# Altium project HW_RV_TOUCH_R1M1.PrjPcb (part 4 of 4)

## Sheet 14_LCD_TS_CT.SchDoc: =TitleParameter
size A3; Address: Crete IL; Organization: ASISGUARD; Address1: Kemalpasa, Kemalpasa Cd. No:290 D:292H, 35060 Bornova/Izmir/Turkey; Revision: R1M1
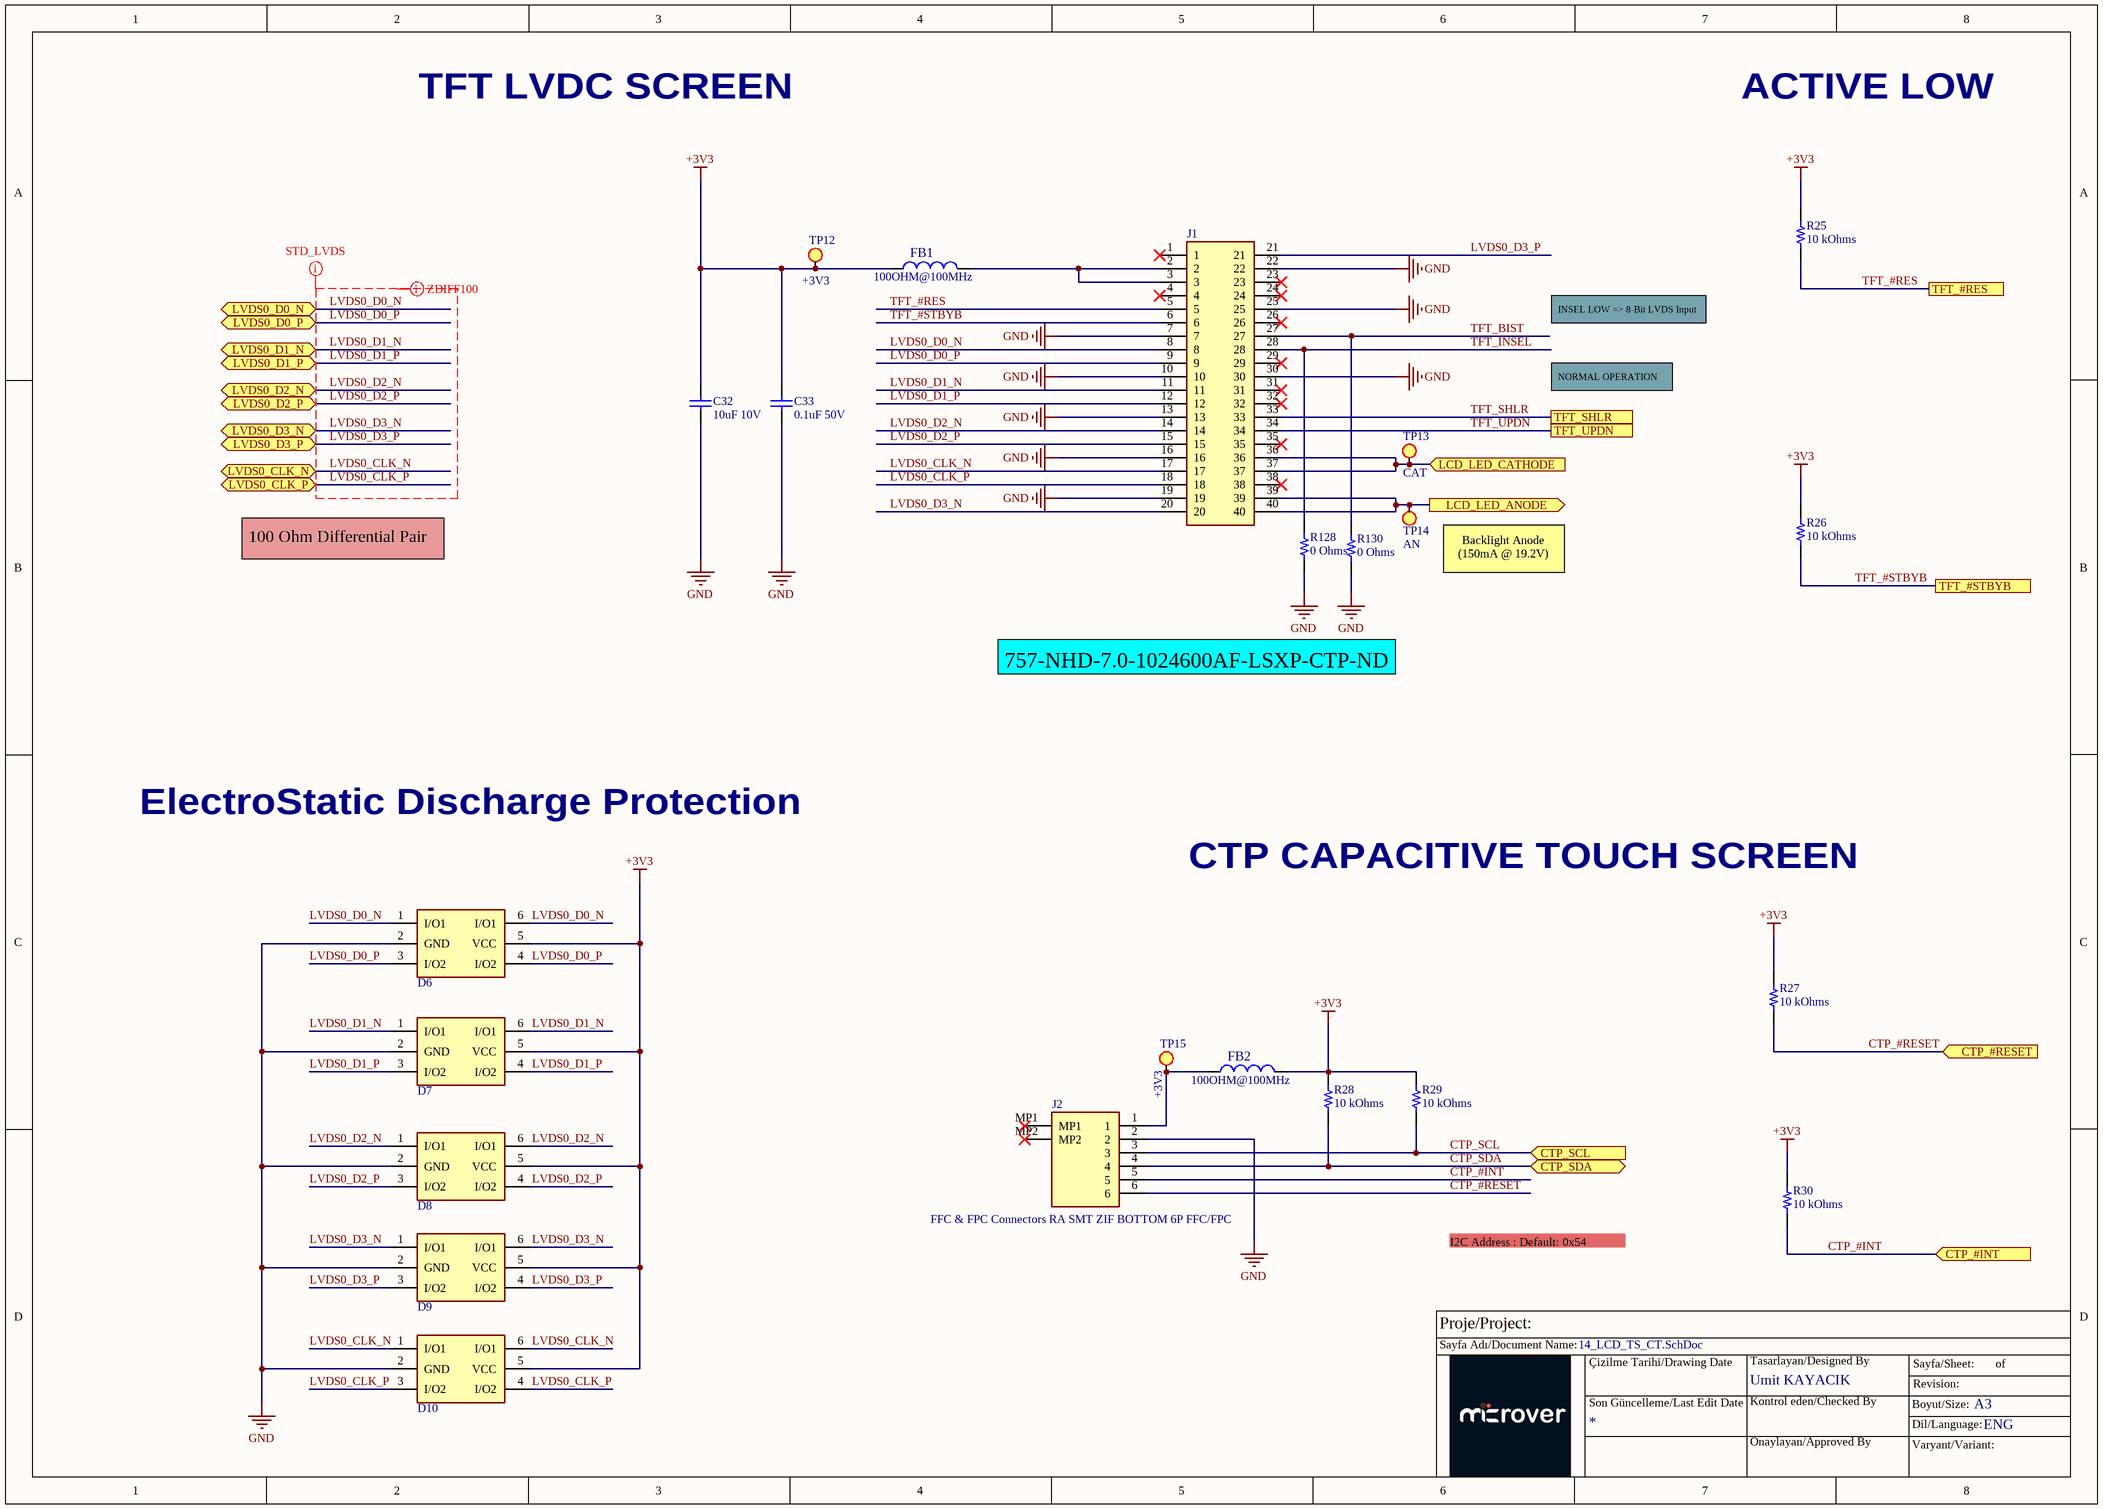
[diagram p13: 14_LCD_TS_CT.SchDoc]

### Parts
C32  value 10uF 10V  [SMC1206]  (hidden comment: CAP CER 10UF 10V X7R 1206)
C33  value 0.1uF 50V  [SMC0603]  (hidden comment: CAP CER 0.1UF 50V X7R 0603)
D6  SON-6(1x1.5) ESD Protection Devices ROHS  [Nexperia_SOT886_MFG]  (value not drawn)
D7  SON-6(1x1.5) ESD Protection Devices ROHS  [Nexperia_SOT886_MFG]  (value not drawn)
D8  SON-6(1x1.5) ESD Protection Devices ROHS  [Nexperia_SOT886_MFG]  (value not drawn)
D9  SON-6(1x1.5) ESD Protection Devices ROHS  [Nexperia_SOT886_MFG]  (value not drawn)
D10  SON-6(1x1.5) ESD Protection Devices ROHS  [Nexperia_SOT886_MFG]  (value not drawn)
FB1  100OHM@100MHz  [FB 0603(1608)]
FB2  100OHM@100MHz  [FB 0603(1608)]
J1  FFC & FPC Connectors 0.5 FPC ZIF SMT R/AU prCont40CktEmbsTpPk  [54104-4031]  (value not drawn)
J2  FFC & FPC Connectors RA SMT ZIF BOTTOM 6P FFC/FPC  [522710679]
R25  10 kOhms  [RES 0402_1005]
R26  10 kOhms  [RES 0402_1005]
R27  10 kOhms  [RES 0402_1005]
R28  10 kOhms  [RES 0402_1005]
R29  10 kOhms  [RES 0402_1005]
R30  10 kOhms  [RES 0402_1005]
R128  0 Ohms  [RES0402(1005)]
R130  0 Ohms  [RES0402(1005)]
TP12  +3V3  [TEST_POINT]
TP13  CAT  [TEST_POINT]
TP14  AN  [TEST_POINT]
TP15  +3V3  [TEST_POINT]

### Ports
CTP_#INT (in), CTP_#RESET (in), CTP_SCL (in), CTP_SDA (bidir), LCD_LED_ANODE (out), LCD_LED_CATHODE (in), LVDS0_CLK_N (bidir), LVDS0_CLK_P (bidir), LVDS0_D0_N (bidir), LVDS0_D0_P (bidir), LVDS0_D1_N (bidir), LVDS0_D1_P (bidir), LVDS0_D2_N (bidir), LVDS0_D2_P (bidir), LVDS0_D3_N (bidir), LVDS0_D3_P (bidir), TFT_#RES, TFT_#STBYB, TFT_SHLR, TFT_UPDN

### Nets
+3V3: C32.2 C33.2 D6.5(VCC) D7.5(VCC) D8.5(VCC) D9.5(VCC) D10.5(VCC) FB1.2 FB2.1 R25.2 R26.2 R27.2 R28.2 R29.2 R30.2 TP12.1(TP)
GND: C32.1 C33.1 D6.2(GND) D7.2(GND) D8.2(GND) D9.2(GND) D10.2(GND) J1.7 J1.10 J1.13 J1.16 J1.19 J1.22 J1.25 J1.30 J2.2 R128.2 R130.2
CTP_#INT: J2.5 R30.1 ; port CTP_#INT
CTP_#RESET: J2.6 R27.1 ; port CTP_#RESET
CTP_SCL: J2.3 R29.1 ; port CTP_SCL
CTP_SDA: J2.4 R28.1 ; port CTP_SDA
LCD_LED_ANODE: J1.39 J1.40 TP14.1(TP) ; port LCD_LED_ANODE
LCD_LED_CATHODE: J1.36 J1.37 TP13.1(TP) ; port LCD_LED_CATHODE
LVDS0_CLK_N: D10.1(I/O1) D10.6(I/O1) J1.17 ; port LVDS0_CLK_N
LVDS0_CLK_P: D10.3(I/O2) D10.4(I/O2) J1.18 ; port LVDS0_CLK_P
LVDS0_D0_N: D6.1(I/O1) D6.6(I/O1) J1.8 ; port LVDS0_D0_N
LVDS0_D0_P: D6.3(I/O2) D6.4(I/O2) J1.9 ; port LVDS0_D0_P
LVDS0_D1_N: D7.1(I/O1) D7.6(I/O1) J1.11 ; port LVDS0_D1_N
LVDS0_D1_P: D7.3(I/O2) D7.4(I/O2) J1.12 ; port LVDS0_D1_P
LVDS0_D2_N: D8.1(I/O1) D8.6(I/O1) J1.14 ; port LVDS0_D2_N
LVDS0_D2_P: D8.3(I/O2) D8.4(I/O2) J1.15 ; port LVDS0_D2_P
LVDS0_D3_N: D9.1(I/O1) D9.6(I/O1) J1.20 ; port LVDS0_D3_N
LVDS0_D3_P: D9.3(I/O2) D9.4(I/O2) J1.21 ; port LVDS0_D3_P
TFT_#RES: J1.5 R25.1 ; port TFT_#RES
TFT_#STBYB: J1.6 R26.1 ; port TFT_#STBYB
TFT_BIST: J1.27 R130.1
TFT_INSEL: J1.28 R128.1
TFT_SHLR: J1.33 ; port TFT_SHLR
TFT_UPDN: J1.34 ; port TFT_UPDN
NetFB1_1: FB1.1 J1.2 J1.3
NetFB2_2: FB2.2 J2.1 TP15.1(TP)

Not connected (* = marked no-connect by the designer): J1 1* 4* 23* 24* 26* 29* 31* 32* 35* 38*; J2 MP1* MP2*

### Layout directives
net class STD_LVDS: LVDS0_CLK_N, LVDS0_CLK_P, LVDS0_D0_N, LVDS0_D0_P, LVDS0_D1_N, LVDS0_D1_P, LVDS0_D2_N, LVDS0_D2_P, LVDS0_D3_N, LVDS0_D3_P
differential pair; differential pair class ZDIFF100: LVDS0_CLK_N, LVDS0_CLK_P, LVDS0_D0_N, LVDS0_D0_P, LVDS0_D1_N, LVDS0_D1_P, LVDS0_D2_N, LVDS0_D2_P, LVDS0_D3_N, LVDS0_D3_P

### Notes on the sheet
- TFT LVDC SCREEN
- ACTIVE LOW
- INSEL LOW => 8-Bit LVDS Input
- NORMAL OPERATION
- 100 Ohm Differential Pair
- (near TP14) Backlight Anode (150mA @ 19.2V)
- 757-NHD-7.0-1024600AF-LSXP-CTP-ND
- ElectroStatic Discharge Protection
- CTP CAPACITIVE TOUCH SCREEN
- I2C Address : Default: 0x54
- Proje/Project:
- Sayfa Adı/Document Name:
- Çizilme Tarihi/Drawing Date
- Umit KAYACIK
- Tasarlayan/Designed By
- Sayfa/Sheet:
- Revision:
- of
- Son Güncelleme/Last Edit Date
- Kontrol eden/Checked By
- Onaylayan/Approved By
- Boyut/Size:
- Varyant/Variant:
- Dil/Language:
- A3
- ENG

### Library data of the parts
C32 = CAP1206_10UF_10V: 10 µF ±10% 10V Ceramic Capacitor X7R 1206 (3216 Metric); Manufacturer Part Number: CL31B106KPHNNNE; Order Code: Digi: 1276-1311-2-ND; Sirius Stock Code: *; LCSC Part Number: C96449; LCSC Manufacturer Part Number: CL31B106KPHNNNE
C33 = CAP0603_0.1UF_50V: 0.1 µF ±10% 50V Ceramic Capacitor X7R 0603 (1608 Metric); Manufacturer Part Number: CL10B104KB8NNNL; LCSC Manufacturer Part Number: CL10B104KB8NNNC; Order Code: DIGI:1276-CL10B104KB8NNNLTR-ND; Sirius Stock Code: A063-AGC10300001226; LCSC Part Number: C1591
D6-D10 = PRTR5V0U2F: Order Code: LCSC: C2937001; Manufacturer Part Number: PRTR5V0U2F; LCSC Manufacturer Part Number: PRTR5V0U2F; LCSC Part Number: C2937001
FB1 FB2 = FB0603_100OHM_100MHz: 100 Ohms @ 100 MHz 1 Power Line Ferrite Bead 0603 (1608 Metric) 2A 40mOhm; Manufacturer: TDK; Manufacturer Part Number: MPZ1608Y101BTA00; Tolerance: 25%; Impedance: 100R; DC Resistance (DCR): 40mR; ComponentLink1URL: https://chn-vm-apps.microchip.com/mchprepo/parts/Datasheets/beads_commercial_power_mpz_en.pdf; ComponentLink1Description: Datasheet; Supplier 1: Digi-Key; Supplier Part Number 1: 445-2984-1-ND; RoHS: Yes; Category: Ferrite Beads and Chips; Stock 1: 551; Pricing 1: 1=0,10000, 10=0,07200, 25=0,06480, 50=0,05840, 100=0,04290, 250=0,03120, 500=0,02860, 1000=0,02470 (USD); Mount: Surface Mount; Case/Package: 0603; Case Code (Metric): 1608; Case Code (Imperial): 0603; Core Material: Ferrite; Packaging: Tape and Reel; Package Quantity: 4000; Max DC Current: 2A; Current Rating: 2A; Series: MPZ; Length: 0.063inch; Width: 0.031inch; Height: 0.037inch; RoHS Compliant: Yes; REACH SVHC: No SVHC; ComponentLink2URL: https://datasheet.ciiva.com/46634/beads-commercial-power-mpz-en-46634677.pdf?src-supplier=Digi-Key; ComponentLink2Description: https://datasheet.ciiva.com/46634/beads-commercial-power-mpz-en-46634677.pdf?src-supplier=Digi-Key; ComponentLink3URL: https://datasheet.ciiva.com/48682/beads-commercial-power-mpz-en-48682501.pdf?src-supplier=Avnet; ComponentLink3Description: https://datasheet.ciiva.com/48682/beads-commercial-power-mpz-en-48682501.pdf?src-supplier=Avnet; ComponentLink4URL: https://datasheet.ciiva.com/46634/beads-commercial-power-mpz-en-46634684.pdf?src-supplier=Digi-Key; ComponentLink4Description: https://datasheet.ciiva.com/46634/beads-commercial-power-mpz-en-46634684.pdf?src-supplier=Digi-Key; ComponentLink5URL: https://datasheet.ciiva.com/46634/beads-commercial-power-mpz-en-46634621.pdf?src-supplier=Digi-Key; ComponentLink5Description: https://datasheet.ciiva.com/46634/beads-commercial-power-mpz-en-46634621.pdf?src-supplier=Digi-Key; Parameter 1: *; LCSC Manufacturer Part Number: MPZ1608Y101BTA00; LCSC Part Number: C501996
J1 = 54104-4031: Conn FFC/FPC Connector SKT 40 POS 0.5mm Solder RA SMD Easy-On™ T/R; Manufacturer: Molex; Actuator Material: Glass,Polyphenylene; Actuator Color: Brown; Plating: 157ConductorMaterial; Number of Contacts: 40; Voltage Rating: 50V; Contact Resistance: 20mR; Current Rating: 500mA; Wire/Cable Type: Straight; Mating Cycles: 20; Contact Location: Top; Gender: Receptacle; Number of Circuits: 40NUMBER; Stackable: 5898YesNo; Supplier 1: Mouser; Manufacturer Part Number: 54104-4031; RoHS: Yes; Category: FFC / FPC; Stock 1: 10870; Pricing 1: 1=3,22, 10=2,84, 50=2,84, 100=2,03, 1000=2,03, 10000=1,76 (USD); Mount: Surface Mount; Contact Material: Bronze; Contact Plating: Unplated,Gold; Housing Color: Natural; Housing Material: Nylon; Material: 150ConductorMaterial; Min Operating Temperature: -20°C; Max Operating Temperature: 85°C; Number of Rows: 1; Termination: Solder; Orientation: Right Angle; Packaging: Tape and Reel; Package Quantity: 1500; Number of Positions: 40; Series: 54104; Length: 25.5mm; Pitch: 0.5mm; Depth: 5.6mm; Radiation Hardening: No; Flammability Rating: UL94 V-0; RoHS Compliant: Yes; Reach SVHC Compliant: Unknown; ELV: 5681ELVCompliant; Supplier Part Number 1: 538-54104-4031
J2 = 52271-0679: FFC/FPC SMT SER 1mm Pitch 6Way RightAngle SMT Female FPC Conn; ZIF Bottom Contact; Manufacturer: Molex; Supplier 1: Mouser; Manufacturer Part Number: 52271-0679; RoHS: Yes; Category: FFC / FPC; Stock 1: 7632; Pricing 1: 1=1,1, 10=0,906, 50=0,906, 100=0,755, 1000=0,604, 10000=0,491 (USD); ComponentLink1URL: https://datasheet.ciiva.com/27051/1301235-27051913.pdf?src-supplier=Jameco; ComponentLink1Description: https://datasheet.ciiva.com/27051/1301235-27051913.pdf?src-supplier=Jameco; ComponentLink2URL: https://datasheet.ciiva.com/5136/0522710679-ffc-fpc-connectors-149405-5136769.pdf?src-supplier=Mouser; ComponentLink2Description: https://datasheet.ciiva.com/5136/0522710679-ffc-fpc-connectors-149405-5136769.pdf?src-supplier=Mouser; ComponentLink3URL: https://datasheet.ciiva.com/30226/212340522710679-ffc-fpc-nectors-30226867.pdf?src-supplier=Onlinecomponents.com; ComponentLink3Description: https://datasheet.ciiva.com/30226/212340522710679-ffc-fpc-nectors-30226867.pdf?src-supplier=Onlinecomponents.com; ComponentLink4URL: https://datasheet.ciiva.com/10034/0522710679-ffc-fpc-connectors-10034899.pdf?src-supplier=Avnet; ComponentLink4Description: https://datasheet.ciiva.com/10034/0522710679-ffc-fpc-connectors-10034899.pdf?src-supplier=Avnet; ComponentLink5URL: https://datasheet.ciiva.com/16123/203510522710679-ffc-fpc-nectors-16123334.pdf?src-supplier=Onlinecomponents.com; ComponentLink5Description: https://datasheet.ciiva.com/16123/203510522710679-ffc-fpc-nectors-16123334.pdf?src-supplier=Onlinecomponents.com; ComponentLink6URL: https://datasheet.ciiva.com/8038/704159-8038352.pdf?src-supplier=Element14; ComponentLink6Description: https://datasheet.ciiva.com/8038/704159-8038352.pdf?src-supplier=Element14; ComponentLink7URL: https://datasheet.ciiva.com/11745/0900766b8078fc42-11745220.pdf?src-supplier=Rs; ComponentLink7Description: https://datasheet.ciiva.com/11745/0900766b8078fc42-11745220.pdf?src-supplier=Rs; ComponentLink8URL: https://datasheet.ciiva.com/14483/704159-14483351.pdf?src-supplier=Farnell; ComponentLink8Description: https://datasheet.ciiva.com/14483/704159-14483351.pdf?src-supplier=Farnell; Supplier Part Number 1: 538-52271-0679
R25-R30 = RP73PF1E10KBTD: RES 10K OHM 0.1% 1/10W 0402; Manufacturer: TE Connectivity Passive Product; Power (Watts): 0.1W, 1/10W; Temperature Coefficient: ±25ppm/°C; Part Number: RP73PF1E10KBTD; Value: 10 kOhms; ComponentLink1Description: Datasheet; ComponentLink1URL: https://www.te.com/commerce/DocumentDelivery/DDEController?Action=srchrtrv&DocNm=1773272&DocType=DS&DocLang=English; ComponentLink2Description: DigiKey Link; ComponentLink2URL: https://www.digikey.com/en/products/detail/te-connectivity-passive-product/RP73PF1E10KBTD/8260957; Composition: Thin Film; Device Package: 0402 (1005 Metric); Height - Seated (Max): 0.014" (0.35mm); LastUpdated: 2/9/2024 8:30:24 PM; Lifecycle Status: Active; Minimum Order: 1; Number of Terminations: 2; Operating Temperature: -55°C ~ 155°C; Package / Case: 0402 (1005 Metric); Packaging: TapeAndReel; PartId: 2434; Part Status: Active; Price: 0.08; Resistance: 10 kOhms; Series: RP73, Holsworthy; Size / Dimension: 0.039" L x 0.020" W (1.00mm x 0.50mm); Supplier 1: DigiKey; Supplier Part Number 1: A127415CT-ND; Supplier Device Package: 0402; Tolerance: ±0.1%
R128 R130 = HCJ0402ZT0R00: RES 0 OHM JUMPER 1/8W 0402; Manufacturer: Stackpole Electronics Inc; Power (Watts): 0.125W, 1/8W; Part Number: HCJ0402ZT0R00; Value: 0 Ohms; ComponentLink1Description: Datasheet; ComponentLink1URL: https://www.seielect.com/catalog/sei-hcj.pdf; ComponentLink2Description: DigiKey Link; ComponentLink2URL: https://www.digikey.com/en/products/detail/stackpole-electronics-inc/HCJ0402ZT0R00/4357659; Composition: Metal Foil; Device Package: 0402 (1005 Metric); Features: Automotive AEC-Q200; Height - Seated (Max): 0.018" (0.45mm); LastUpdated: 2/9/2024 8:29:49 PM; Lifecycle Status: Active; Minimum Order: 1; Number of Terminations: 2; Operating Temperature: -55°C ~ 155°C; Package / Case: 0402 (1005 Metric); Packaging: TapeAndReel; PartId: 12327; Part Status: Active; Price: 0.07; Ratings: AEC-Q200; Resistance: 0 Ohms; Series: HCJ; Size / Dimension: 0.039" L x 0.020" W (1.00mm x 0.50mm); Supplier 1: DigiKey; Supplier Part Number 1: HCJ0402ZT0R00CT-ND; Supplier Device Package: 0402; Tolerance: Jumper
TP12-TP15 = TP_1

## Sheet 15_CAN_BUS.SchDoc: =TitleParameter
size A3; Address: Crete IL; Organization: ASISGUARD; Address1: Kemalpasa, Kemalpasa Cd. No:290 D:292H, 35060 Bornova/Izmir/Turkey; Revision: R1M1
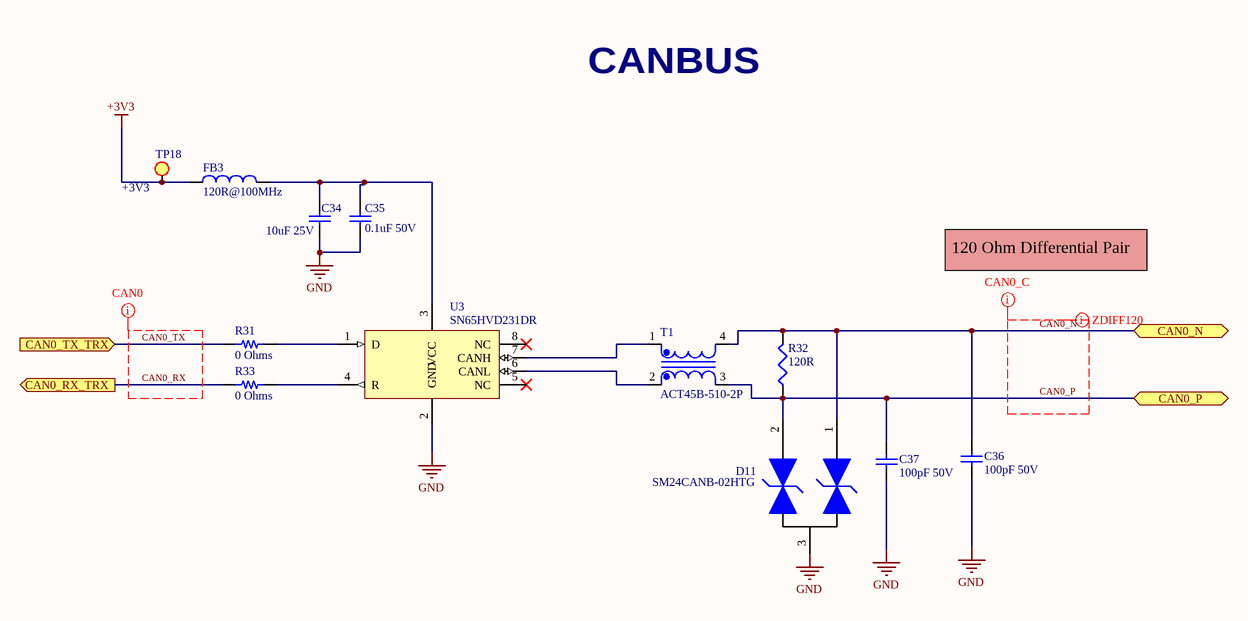
[diagram p14: 15_CAN_BUS.SchDoc]

### Parts
C34  value 10uF 25V  [SMC0805]  (hidden comment: CAP CER 10UF 25V X5R 0805)
C35  value 0.1uF 50V  [SMC0603]  (hidden comment: CAP CER 0.1UF 50V X7R 0603)
C36  value 100pF 50V  [SMC0603]  (hidden comment: CAP CER 100PF 50V C0G/NP0 0603)
C37  value 100pF 50V  [SMC0603]  (hidden comment: CAP CER 100PF 50V C0G/NP0 0603)
D11  Manufacturer Part Number: SM24CANB-02HTG  [SOT23_3-DIODE]  (hidden comment: CAN)
FB3  value 120R@100MHz  [FB 0603(1608)]  (hidden comment: FERRITE BEAD 120 OHM 0603 1LN)
R31  0 Ohms  [RES 0402_1005]
R32  value 120R  [RES1206]  (hidden comment: RES SMD 120 OHM 1% 1/4W 1206)
R33  0 Ohms  [RES 0402_1005]
T1  ACT45B-510-2P  [TDK_ACT45B-510-2P-TL003_0]
TP18  +3V3  [TEST_POINT]
U3  IC TRANSCEIVER HALF 1/1 8SOIC  [SOIC8 - duplicate]  (value not drawn)

### Ports
CAN0_N (bidir), CAN0_P (bidir), CAN0_RX_TRX (out), CAN0_TX_TRX (in)

### Nets
+3V3: FB3.1 TP18.1(TP)
GND: C34.1 C35.1 C36.1 C37.1 D11.3 U3.2(GND)
CAN0_N: C36.2 D11.1 R32.2 T1.4 ; port CAN0_N
CAN0_P: C37.2 D11.2 R32.1 T1.3 ; port CAN0_P
CAN0_RX: R33.2 ; port CAN0_RX_TRX
CAN0_TX: R31.2 ; port CAN0_TX_TRX
NetC34_2: C34.2 C35.2 FB3.2 U3.3(VCC)
NetR31_1: R31.1 U3.1(D)
NetR33_1: R33.1 U3.4(R)
NetT1_1: T1.1 U3.7(CANH)
NetT1_2: T1.2 U3.6(CANL)

Not connected (* = marked no-connect by the designer): U3 5(NC)* 8(NC)*

### Layout directives
differential pair; differential pair class ZDIFF120: CAN0_N, CAN0_P
net class CAN0_C: CAN0_N, CAN0_P
net class CAN0: CAN0_RX, CAN0_TX

### Notes on the sheet
- CANBUS
- 120 Ohm Differential Pair
- Proje/Project:
- Sayfa Adı/Document Name:
- Çizilme Tarihi/Drawing Date
- Umit KAYACIK
- Tasarlayan/Designed By
- Sayfa/Sheet:
- Revision:
- of
- Son Güncelleme/Last Edit Date
- Kontrol eden/Checked By
- Onaylayan/Approved By
- Boyut/Size:
- Varyant/Variant:
- Dil/Language:
- A3
- ENG

### Library data of the parts
C34 = CAP0805_10UF_25V: 10 µF ±10% 25V Ceramic Capacitor X5R 0805 (2012 Metric); Manufacturer Part Number: CL21A106KAYNNNE; Order Code: DIGI: 1276-2891-2-ND; Sirius Stock Code: *; LCSC Manufacturer Part Number: CL21A106KAYNNNE; LCSC Part Number: C15850
C35 = CAP0603_0.1UF_50V: as C33 on sheet 14_LCD_TS_CT; LCSC Part Number: C1591
C36 C37 = CAP0603_100PF_50V: 100 pF ±5% 50V Ceramic Capacitor C0G, NP0 0603 (1608 Metric); Manufacturer Part Number: 06035A101JAT2A; LCSC Manufacturer Part Number: CC0603JRNPO9BN101; Order Code: DIGI: 478-1175-2-ND; Sirius Stock Code: *; LCSC Part Number: C14665
D11 = SM24CANB-02HTG_TVS: TVS DIODE 24VWM 50VC SOT23-3; Order Code: DIGI : F6707CT-ND; Value: 2Ch; LCSC Manufacturer Part Number: SM24CANB-02HTG; LCSC Part Number: C151237
FB3 = FB0603_120R@100MHz: 120 Ohms @ 100 MHz 1 Power Line Ferrite Bead 0603 (1608 Metric) 3A 30mOhm; Manufacturer Part Number: BLM18KG121TH1D; Order Code: Digi:490-13261-2-ND; LCSC Manufacturer Part Number: BLM18KG121TH1D; LCSC Part Number: C437404
R31 R33 = HCJ0402ZT0R00: as R128 on sheet 14_LCD_TS_CT; Part Number: HCJ0402ZT0R00; Value: 0 Ohms; ComponentLink1Description: Datasheet; ComponentLink1URL: https://www.seielect.com/catalog/sei-hcj.pdf; ComponentLink2Description: DigiKey Link; ComponentLink2URL: https://www.digikey.com/en/products/detail/stackpole-electronics-inc/HCJ0402ZT0R00/4357659; Composition: Metal Foil; Device Package: 0402 (1005 Metric); Features: Automotive AEC-Q200; Height - Seated (Max): 0.018" (0.45mm); LastUpdated: 2/9/2024 8:29:49 PM; Lifecycle Status: Active; Minimum Order: 1; Number of Terminations: 2; Operating Temperature: -55°C ~ 155°C; Package / Case: 0402 (1005 Metric); Packaging: TapeAndReel; PartId: 12327; Part Status: Active; Price: 0.07; Ratings: AEC-Q200; Resistance: 0 Ohms; Series: HCJ; Size / Dimension: 0.039" L x 0.020" W (1.00mm x 0.50mm); Supplier 1: DigiKey; Supplier Part Number 1: HCJ0402ZT0R00CT-ND; Supplier Device Package: 0402; Tolerance: Jumper
R32 = RES1206_120R_%1: 120 Ohms ±1% 0.25W, 1/4W Chip Resistor 1206 (3216 Metric) Automotive AEC-Q200, Moisture Resistant Thick Film; Manufacturer Part Number: AC1206FR-07120RL; Order Code: Digi: YAG3810TR-ND; Sirius Stock Code: *; LCSC Manufacturer Part Number: AC1206FR-07120RL; LCSC Part Number: C229293
T1 = ACT45B-510-2P: Ind Common Mode Filter Wirewound 51uH 2KOhm -30% to 50% 100KHz 200mA 1812 T/R; Manufacturer: TDK; Manufacturer Part Number: ACT45B-510-2P-TL003; Core Material: Ferrite; Impedance: 2.8kR; DC Resistance (DCR): 1R; Number of Lines: 2; Voltage Rating (DC): 50V; Test Frequency: 10MHz; Insulation Resistance: 10MR; Element Configuration: Dual; Supplier 1: Digi-Key; Supplier Part Number 1: 445-3958-1-ND; RoHS: Yes; Category: Fixed Inductors; Stock 1: 75821; Pricing 1: 1=1,95000, 10=1,80000, 25=1,65000, 50=1,41000, 100=1,26000, 250=1,08000, 500=1,02000, 1000=0,93000 (USD); Mount: Surface Mount; Case/Package: 1812; Number of Pins: 4; Case Code (Imperial): 1812; Min Operating Temperature: -40°C; Max Operating Temperature: 150°C; Inductance: 51uH; Packaging: Tape and Reel; Package Quantity: 2000; Tolerance: 50%; Current Rating: 200mA; Max DC Current: 200mA; Current: 200mA; Voltage Rating: 50V; Termination: SMD/SMT; DC Current: 200mA; Self Resonant Frequency: 10MHz; Length: 4.7mm; Width: 3.2mm; Height: 2.8mm; Depth: 3.4mm; Radiation Hardening: No; REACH SVHC: No SVHC; Lead Free: Lead Free; Military Standard: Not; ComponentLink1URL: https://datasheet.ciiva.com/22726/1649098-22726290.pdf?src-supplier=Element14; ComponentLink1Description: https://datasheet.ciiva.com/22726/1649098-22726290.pdf?src-supplier=Element14; ComponentLink2URL: https://datasheet.ciiva.com/26793/act45b-510-2p-tl003-26793344.pdf?src-supplier=IIIC; ComponentLink2Description: https://datasheet.ciiva.com/26793/act45b-510-2p-tl003-26793344.pdf?src-supplier=IIIC; ComponentLink3URL: https://datasheet.ciiva.com/8498/e9711-act-8498633.pdf?src-supplier=Avnet; ComponentLink3Description: https://datasheet.ciiva.com/8498/e9711-act-8498633.pdf?src-supplier=Avnet; ComponentLink4URL: https://datasheet.ciiva.com/1007/e9711-act-1007931.pdf?src-supplier=Digi-Key; ComponentLink4Description: https://datasheet.ciiva.com/1007/e9711-act-1007931.pdf?src-supplier=Digi-Key; ComponentLink5URL: https://datasheet.ciiva.com/15191/getdatasheetpartid-349822-15191803.pdf?src-supplier=Verical; ComponentLink5Description: https://datasheet.ciiva.com/15191/getdatasheetpartid-349822-15191803.pdf?src-supplier=Verical; ComponentLink6URL: https://datasheet.ciiva.com/1007/e9711-act-1007932.pdf?src-supplier=Digi-Key; ComponentLink6Description: https://datasheet.ciiva.com/1007/e9711-act-1007932.pdf?src-supplier=Digi-Key; ComponentLink7URL: https://datasheet.ciiva.com/1007/e9711-act-1007933.pdf?src-supplier=Digi-Key; ComponentLink7Description: https://datasheet.ciiva.com/1007/e9711-act-1007933.pdf?src-supplier=Digi-Key; ComponentLink8URL: https://datasheet.ciiva.com/7649/1833202-7649183.pdf?src-supplier=Element14; ComponentLink8Description: https://datasheet.ciiva.com/7649/1833202-7649183.pdf?src-supplier=Element14; LCSC Manufacturer Part Number: ACT45B-510-2P-TL003; LCSC Part Number: C76584
TP18 = TP_1
U3 = SN65HVD231DR: 1/1 Transceiver Half CANbus 8-SOIC; Order Code: DIGI : 296-26343-2-ND; Value: CAN; LCSC Manufacturer Part Number: SN65HVD231DR; LCSC Part Number: C129257; P/N: SN65HVD231DR

## Sheet 16_DEBUG.SchDoc: =TitleParameter
size A3; Address: Crete IL; Organization: ASISGUARD; Address1: Kemalpasa, Kemalpasa Cd. No:290 D:292H, 35060 Bornova/Izmir/Turkey; Revision: R1M1
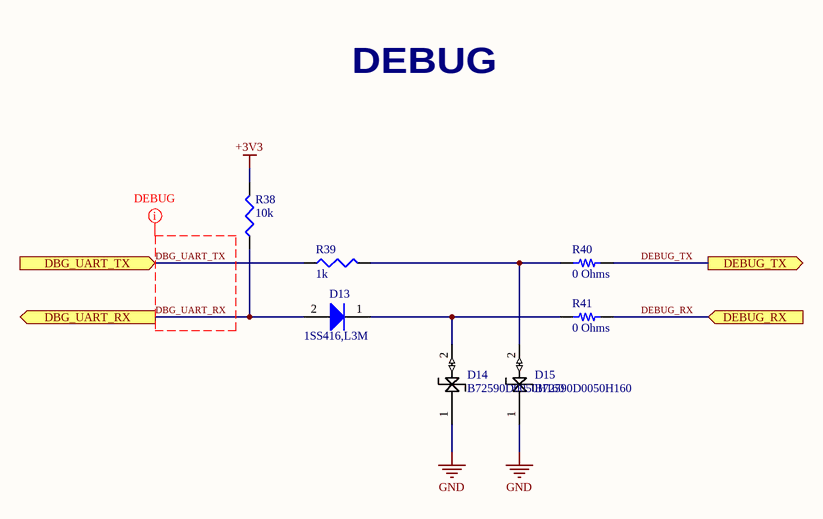
[diagram p15: 16_DEBUG.SchDoc]

### Parts
D13  1SS416,L3M  [SOD-923-2]
D14  B72590D0050H160  [SOD1005X60N]
D15  B72590D0050H160  [SOD1005X60N]
R38  value 10k  [RES0402(1005)]  (hidden comment: RES 10K OHM 1% 1/16W 0402)
R39  value 1k  [RES0402(1005)]  (hidden comment: RES 1K OHM 1% 1/16W 0402)
R40  0 Ohms  [RES 0402_1005]
R41  0 Ohms  [RES 0402_1005]

### Ports
DBG_UART_RX (out), DBG_UART_TX (in), DEBUG_RX (in), DEBUG_TX (out)

### Nets
+3V3: R38.2
GND: D14.1(GND) D15.1(GND)
DBG_UART_RX: D13.2(A) R38.1 ; port DBG_UART_RX
DBG_UART_TX: R39.2 ; port DBG_UART_TX
DEBUG_RX: R41.1 ; port DEBUG_RX
DEBUG_TX: R40.1 ; port DEBUG_TX
NetD13_1: D13.1(K) D14.2(I/OLINE) R41.2
NetD15_2: D15.2(I/OLINE) R39.1 R40.2

### Layout directives
net class DEBUG: DBG_UART_RX, DBG_UART_TX

### Notes on the sheet
- DEBUG
- Proje/Project:
- Sayfa Adı/Document Name:
- Çizilme Tarihi/Drawing Date
- Umit KAYACIK
- Tasarlayan/Designed By
- Sayfa/Sheet:
- Revision:
- of
- Son Güncelleme/Last Edit Date
- Kontrol eden/Checked By
- Onaylayan/Approved By
- Boyut/Size:
- Varyant/Variant:
- Dil/Language:
- A3
- ENG

### Library data of the parts
D13 = 1SS416,L3M: Diode 30 V 100mA Surface Mount SOD-923; LCSC Manufacturer Part Number: 1SS416,L3M(B; Order Code: Digi: 1SS416L3MTR-ND; LCSC Part Number: C2943683; Manufacturer Part Number: 1SS416,L3M
D14 D15 = B72590D0050H160: VARISTOR 150V 0402; Manufacturer: TDK EPCOS; Supplier 1: Digikey; Manufacturer Part Number: B72590D0050H160; RoHS: Yes; Category: Varistors; Stock 1: 130000; Pricing 1: 10000=0,04977, 30000=0,04666, 50000=0,04137, 100000=0,04044, 250000=0,03982 (USD); ComponentLink1URL: https://datasheet.octopart.com/B72590D0050H160-EPCOS-datasheet-10468447.pdf?src-supplier=Newark; ComponentLink1Description: https://datasheet.octopart.com/B72590D0050H160-EPCOS-datasheet-10468447.pdf?src-supplier=Newark; ComponentLink2URL: https://en.tdk.eu/inf/75/ds/High_speed_series.pdf?src-supplier=Verical; ComponentLink2Description: https://en.tdk.eu/inf/75/ds/High_speed_series.pdf?src-supplier=Verical; ComponentLink3URL: http://www.farnell.com/datasheets/1706828.pdf?src-supplier=Newark; ComponentLink3Description: http://www.farnell.com/datasheets/1706828.pdf?src-supplier=Newark; ComponentLink4URL: https://en.tdk.eu/inf/75/ds/High_speed_series.pdf?src-supplier=Digikey; ComponentLink4Description: https://en.tdk.eu/inf/75/ds/High_speed_series.pdf?src-supplier=Digikey; ComponentLink5URL: https://www.tdk-electronics.tdk.com/inf/75/ds/High_speed_series.pdf?src-supplier=Digikey; ComponentLink5Description: https://www.tdk-electronics.tdk.com/inf/75/ds/High_speed_series.pdf?src-supplier=Digikey; ComponentLink6URL: https://en.tdk.eu/inf/75/ds/High_speed_series.pdf?src-supplier=Arrow+Electronics; ComponentLink6Description: https://en.tdk.eu/inf/75/ds/High_speed_series.pdf?src-supplier=Arrow+Electronics; ComponentLink7URL: https://en.tdk.eu/inf/75/ds/High_speed_series.pdf?src-supplier=Quest; ComponentLink7Description: https://en.tdk.eu/inf/75/ds/High_speed_series.pdf?src-supplier=Quest; ComponentLink8URL: https://datasheet.octopart.com/B72590D0050H160-EPCOS-datasheet-157245974.pdf?src-supplier=LKR; ComponentLink8Description: https://datasheet.octopart.com/B72590D0050H160-EPCOS-datasheet-157245974.pdf?src-supplier=LKR; ComponentLink9URL: https://en.tdk.eu/inf/75/ds/High_speed_series.pdf?src-supplier=TTI; ComponentLink9Description: https://en.tdk.eu/inf/75/ds/High_speed_series.pdf?src-supplier=TTI; Supplier Part Number 1: 495-3684-2-ND
R38 = RES0402_10K_%1: 10 kOhms ±1% 0.063W, 1/16W Chip Resistor 0402 (1005 Metric) Moisture Resistant Thick Film; Manufacturer Part Number: RC0402FR-0710KL; Order Code: Digi: 311-10.0KLRTR-ND; Sirius Stock Code: *; LCSC Manufacturer Part Number: RC0402FR-0710KL; LCSC Part Number: C60490
R39 = RES0402_1K_%1: 1 kOhms ±1% 0.063W, 1/16W Chip Resistor 0402 (1005 Metric) Moisture Resistant Thick Film; Manufacturer Part Number: RC0402FR-071KL; Order Code: Digi: 311-1.00KLRTR-ND; Sirius Stock Code: *; LCSC Manufacturer Part Number: RC0402FR-071KL; LCSC Part Number: C106235
R40 R41 = HCJ0402ZT0R00: as R128 on sheet 14_LCD_TS_CT; Part Number: HCJ0402ZT0R00; Value: 0 Ohms; ComponentLink1Description: Datasheet; ComponentLink1URL: https://www.seielect.com/catalog/sei-hcj.pdf; ComponentLink2Description: DigiKey Link; ComponentLink2URL: https://www.digikey.com/en/products/detail/stackpole-electronics-inc/HCJ0402ZT0R00/4357659; Composition: Metal Foil; Device Package: 0402 (1005 Metric); Features: Automotive AEC-Q200; Height - Seated (Max): 0.018" (0.45mm); LastUpdated: 2/9/2024 8:29:49 PM; Lifecycle Status: Active; Minimum Order: 1; Number of Terminations: 2; Operating Temperature: -55°C ~ 155°C; Package / Case: 0402 (1005 Metric); Packaging: TapeAndReel; PartId: 12327; Part Status: Active; Price: 0.07; Ratings: AEC-Q200; Resistance: 0 Ohms; Series: HCJ; Size / Dimension: 0.039" L x 0.020" W (1.00mm x 0.50mm); Supplier 1: DigiKey; Supplier Part Number 1: HCJ0402ZT0R00CT-ND; Supplier Device Package: 0402; Tolerance: Jumper

## Sheet 17_SD_CARD.SchDoc: =TitleParameter
size A3; Address: Crete IL; Organization: ASISGUARD; Address1: Kemalpasa, Kemalpasa Cd. No:290 D:292H, 35060 Bornova/Izmir/Turkey; Revision: R1M1
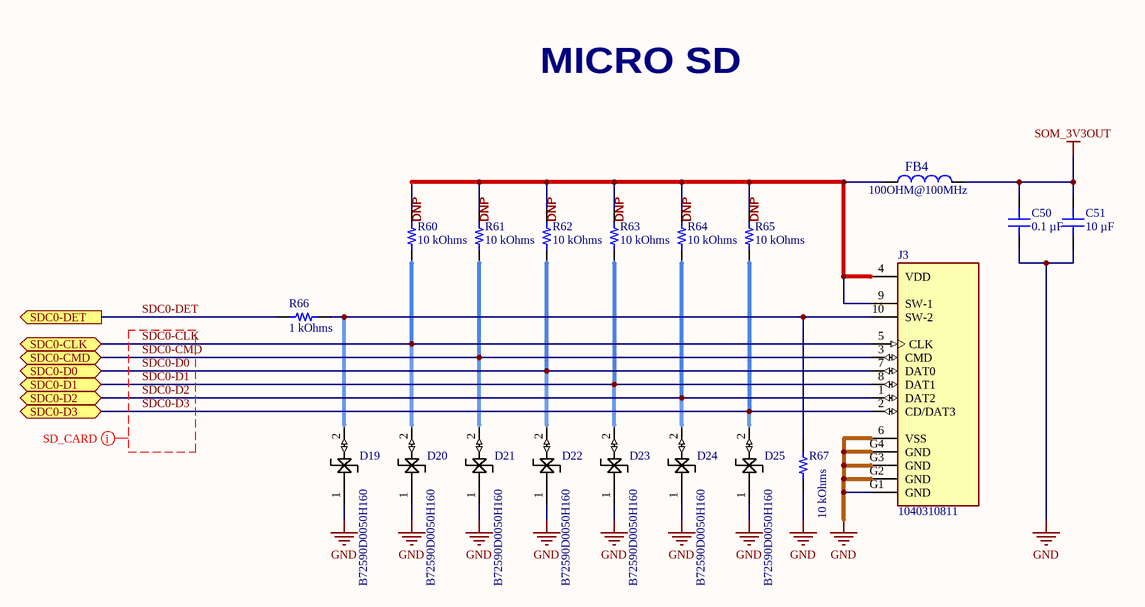
[diagram p16: 17_SD_CARD.SchDoc]

### Parts
C50  0.1 µF  [CAP 0603_1608]
C51  10 µF  [CAP 0603_1608]
D19  B72590D0050H160  [SOD1005X60N]
D20  B72590D0050H160  [SOD1005X60N]
D21  B72590D0050H160  [SOD1005X60N]
D22  B72590D0050H160  [SOD1005X60N]
D23  B72590D0050H160  [SOD1005X60N]
D24  B72590D0050H160  [SOD1005X60N]
D25  B72590D0050H160  [SOD1005X60N]
FB4  100OHM@100MHz  [FB 0603(1608)]
J3  1040310811  [MOLEX_104031-0811]
R60  10 kOhms  [RES 0402_1005]
R61  10 kOhms  [RES 0402_1005]
R62  10 kOhms  [RES 0402_1005]
R63  10 kOhms  [RES 0402_1005]
R64  10 kOhms  [RES 0402_1005]
R65  10 kOhms  [RES 0402_1005]
R66  1 kOhms  [RES 0402_1005]
R67  10 kOhms  [RES 0402_1005]

### Ports
SDC0-CLK (bidir), SDC0-CMD (bidir), SDC0-D0 (bidir), SDC0-D1 (bidir), SDC0-D2 (bidir), SDC0-D3 (bidir), SDC0-DET (out)

### Nets
GND: C50.1 C51.1 D19.1(GND) D20.1(GND) D21.1(GND) D22.1(GND) D23.1(GND) D24.1(GND) D25.1(GND) J3.6(VSS) J3.G1(GND) J3.G2(GND) J3.G3(GND) J3.G4(GND) R67.1
SOM_3V3OUT: C50.2 C51.2 FB4.1
SDC0-CLK: D20.2(I/OLINE) J3.5(CLK) R60.1 ; port SDC0-CLK
SDC0-CMD: D21.2(I/OLINE) J3.3(CMD) R61.1 ; port SDC0-CMD
SDC0-D0: D22.2(I/OLINE) J3.7(DAT0) R62.1 ; port SDC0-D0
SDC0-D1: D23.2(I/OLINE) J3.8(DAT1) R63.1 ; port SDC0-D1
SDC0-D2: D24.2(I/OLINE) J3.1(DAT2) R64.1 ; port SDC0-D2
SDC0-D3: D25.2(I/OLINE) J3.2(CD/DAT3) R65.1 ; port SDC0-D3
SDC0-DET: R66.1 ; port SDC0-DET
NetD19_2: D19.2(I/OLINE) J3.10(SW-2) R66.2 R67.2
NetFB4_2: FB4.2 J3.4(VDD) J3.9(SW-1) R60.2 R61.2 R62.2 R63.2 R64.2 R65.2

### Layout directives
net class SD_CARD: SDC0-CLK, SDC0-CMD, SDC0-D0, SDC0-D1, SDC0-D2, SDC0-D3

### Notes on the sheet
- MICRO SD
- (near R60) DNP
- (near R61) DNP
- (near R62) DNP
- (near R63) DNP
- (near R64) DNP
- (near R65) DNP
- Proje/Project:
- Sayfa Adı/Document Name:
- Çizilme Tarihi/Drawing Date
- Umit KAYACIK
- Tasarlayan/Designed By
- Sayfa/Sheet:
- Revision:
- of
- Son Güncelleme/Last Edit Date
- Kontrol eden/Checked By
- Onaylayan/Approved By
- Boyut/Size:
- Varyant/Variant:
- Dil/Language:
- A3
- ENG

### Library data of the parts
C50 = VJ0603Y104KXAPW1BC: CAP CER 0.1UF 50V X7R 0603; manufacturer: Vishay Vitramon; Tolerance: ±10%; Part Number: VJ0603Y104KXAPW1BC; Value: 0.1 µF; Applications: General Purpose; Capacitance: 0.1 µF; componentlink2description: DigiKey Link; componentlink2url: https://www.digikey.com/en/products/detail/vishay-vitramon/VJ0603Y104KXAPW1BC/10670836; Device Package: 0603 (1608 Metric); lastupdated: 2/9/2024 8:09:50 PM; Lifecycle Status: Active; Minimum Order: 1; Mounting Type: Surface Mount, MLCC; Operating Temperature: -55°C ~ 125°C; Package / Case: 0603 (1608 Metric); packaging: TapeAndReel; partid: 45127; Part Status: Active; price: 0.02; series: VJ W1BC; Size / Dimension: 0.063" L x 0.031" W (1.60mm x 0.80mm); Supplier 1: DigiKey; Supplier Part Number 1: 720-VJ0603Y104KXAPW1BCCT-ND; Temperature Coefficient: X7R; Thickness (Max): 0.037" (0.95mm); Voltage - Rated: 50V
C51 = KGM15CR51C106KT: CAP CER 10UF 16V X5R 0603; manufacturer: KYOCERA AVX; Tolerance: ±10%; Part Number: KGM15CR51C106KT; Value: 10 µF; Applications: General Purpose; Capacitance: 10 µF; componentlink1description: Datasheet; componentlink1url: https://datasheets.kyocera-avx.com/cx5r.pdf; componentlink2description: DigiKey Link; componentlink2url: https://www.digikey.com/en/products/detail/kyocera-avx/KGM15CR51C106KT/17866320; Device Package: 0603 (1608 Metric); lastupdated: 2/9/2024 8:08:56 PM; Lifecycle Status: Active; Minimum Order: 1; Mounting Type: Surface Mount, MLCC; Operating Temperature: -55°C ~ 85°C; Package / Case: 0603 (1608 Metric); packaging: TapeAndReel; partid: 54717; Part Status: Active; price: 0.03; series: KGM - X5R; Size / Dimension: 0.063" L x 0.031" W (1.60mm x 0.80mm); Supplier 1: DigiKey; Supplier Part Number 1: 478-KGM15CR51C106KTCT-ND; Temperature Coefficient: X5R; Thickness (Max): 0.039" (1.00mm); Voltage - Rated: 16V
D19-D25 = B72590D0050H160: as D14 on sheet 16_DEBUG; Supplier 1: Digikey; Manufacturer Part Number: B72590D0050H160; RoHS: Yes; Category: Varistors; Stock 1: 130000; Pricing 1: 10000=0,04977, 30000=0,04666, 50000=0,04137, 100000=0,04044, 250000=0,03982 (USD); ComponentLink1URL: https://datasheet.octopart.com/B72590D0050H160-EPCOS-datasheet-10468447.pdf?src-supplier=Newark; ComponentLink1Description: https://datasheet.octopart.com/B72590D0050H160-EPCOS-datasheet-10468447.pdf?src-supplier=Newark; ComponentLink2URL: https://en.tdk.eu/inf/75/ds/High_speed_series.pdf?src-supplier=Verical; ComponentLink2Description: https://en.tdk.eu/inf/75/ds/High_speed_series.pdf?src-supplier=Verical; ComponentLink3URL: http://www.farnell.com/datasheets/1706828.pdf?src-supplier=Newark; ComponentLink3Description: http://www.farnell.com/datasheets/1706828.pdf?src-supplier=Newark; ComponentLink4URL: https://en.tdk.eu/inf/75/ds/High_speed_series.pdf?src-supplier=Digikey; ComponentLink4Description: https://en.tdk.eu/inf/75/ds/High_speed_series.pdf?src-supplier=Digikey; ComponentLink5URL: https://www.tdk-electronics.tdk.com/inf/75/ds/High_speed_series.pdf?src-supplier=Digikey; ComponentLink5Description: https://www.tdk-electronics.tdk.com/inf/75/ds/High_speed_series.pdf?src-supplier=Digikey; ComponentLink6URL: https://en.tdk.eu/inf/75/ds/High_speed_series.pdf?src-supplier=Arrow+Electronics; ComponentLink6Description: https://en.tdk.eu/inf/75/ds/High_speed_series.pdf?src-supplier=Arrow+Electronics; ComponentLink7URL: https://en.tdk.eu/inf/75/ds/High_speed_series.pdf?src-supplier=Quest; ComponentLink7Description: https://en.tdk.eu/inf/75/ds/High_speed_series.pdf?src-supplier=Quest; ComponentLink8URL: https://datasheet.octopart.com/B72590D0050H160-EPCOS-datasheet-157245974.pdf?src-supplier=LKR; ComponentLink8Description: https://datasheet.octopart.com/B72590D0050H160-EPCOS-datasheet-157245974.pdf?src-supplier=LKR; ComponentLink9URL: https://en.tdk.eu/inf/75/ds/High_speed_series.pdf?src-supplier=TTI; ComponentLink9Description: https://en.tdk.eu/inf/75/ds/High_speed_series.pdf?src-supplier=TTI; Supplier Part Number 1: 495-3684-2-ND
FB4 = FB0603_100OHM_100MHz: as FB1 on sheet 14_LCD_TS_CT; ComponentLink1URL: https://chn-vm-apps.microchip.com/mchprepo/parts/Datasheets/beads_commercial_power_mpz_en.pdf; ComponentLink1Description: Datasheet; Supplier 1: Digi-Key; Supplier Part Number 1: 445-2984-1-ND; RoHS: Yes; Category: Ferrite Beads and Chips; Stock 1: 551; Pricing 1: 1=0,10000, 10=0,07200, 25=0,06480, 50=0,05840, 100=0,04290, 250=0,03120, 500=0,02860, 1000=0,02470 (USD); Mount: Surface Mount; Case/Package: 0603; Case Code (Metric): 1608; Case Code (Imperial): 0603; Core Material: Ferrite; Packaging: Tape and Reel; Package Quantity: 4000; Max DC Current: 2A; Current Rating: 2A; Series: MPZ; Length: 0.063inch; Width: 0.031inch; Height: 0.037inch; RoHS Compliant: Yes; REACH SVHC: No SVHC; ComponentLink2URL: https://datasheet.ciiva.com/46634/beads-commercial-power-mpz-en-46634677.pdf?src-supplier=Digi-Key; ComponentLink2Description: https://datasheet.ciiva.com/46634/beads-commercial-power-mpz-en-46634677.pdf?src-supplier=Digi-Key; ComponentLink3URL: https://datasheet.ciiva.com/48682/beads-commercial-power-mpz-en-48682501.pdf?src-supplier=Avnet; ComponentLink3Description: https://datasheet.ciiva.com/48682/beads-commercial-power-mpz-en-48682501.pdf?src-supplier=Avnet; ComponentLink4URL: https://datasheet.ciiva.com/46634/beads-commercial-power-mpz-en-46634684.pdf?src-supplier=Digi-Key; ComponentLink4Description: https://datasheet.ciiva.com/46634/beads-commercial-power-mpz-en-46634684.pdf?src-supplier=Digi-Key; ComponentLink5URL: https://datasheet.ciiva.com/46634/beads-commercial-power-mpz-en-46634621.pdf?src-supplier=Digi-Key; ComponentLink5Description: https://datasheet.ciiva.com/46634/beads-commercial-power-mpz-en-46634621.pdf?src-supplier=Digi-Key; Parameter 1: *; LCSC Manufacturer Part Number: MPZ1608Y101BTA00; LCSC Part Number: C501996
J3 = 1040310811: 1.10mm Pitch microSD Memory Card Connector, SMT, Push-Pull Type, 1.42mm Height, with Detect Switch; Manufacturer: Molex; Number of Contacts: 8; Gender: Female; Pitch: 1.1mm; Supplier 1: Digikey; Manufacturer Part Number: 1040310811; RoHS: Yes; Category: Memory Connectors; Stock 1: 36000; Pricing 1: 2000=1.20529, 4000=1.16372, 6000=1.10554 (USD); Mount: Surface Mount; Contact Material: Bronze; Contact Plating: Gold; Housing Material: Polymer; Min Operating Temperature: -25°C; Max Operating Temperature: 85°C; Number of Rows: 1; Orientation: Right Angle; Packaging: Tape and Reel; Termination: Solder; Number of Circuits: 8; Series: 103041; Length: 11.14mm; Width: 11.4mm; Depth: 11.4mm; Radiation Hardening: No; Halogen Free: Low Halogen; Reach SVHC Compliant: Unknown; ComponentLink1URL: https://datasheet.ciiva.com/4581/1040310811-memory-card-socket-153593-4581012.pdf?src-supplier=Mouser; ComponentLink1Description: https://datasheet.ciiva.com/4581/1040310811-memory-card-socket-153593-4581012.pdf?src-supplier=Mouser; ComponentLink2URL: https://datasheet.ciiva.com/683/1040310811-sd-683579.pdf?src-supplier=Digikey; ComponentLink2Description: https://datasheet.ciiva.com/683/1040310811-sd-683579.pdf?src-supplier=Digikey; ComponentLink3URL: https://datasheet.ciiva.com/16655/1040310811-memory-card-socket-16655292.pdf?; ComponentLink3Description: https://datasheet.ciiva.com/16655/1040310811-memory-card-socket-16655292.pdf?; ComponentLink4URL: https://datasheet.ciiva.com/3121/1040310811-memory-card-socket-3121437.pdf?src-supplier=Avnet; ComponentLink4Description: https://datasheet.ciiva.com/3121/1040310811-memory-card-socket-3121437.pdf?src-supplier=Avnet; ComponentLink5URL: https://datasheet.ciiva.com/683/1040310811-sd-683580.pdf?src-supplier=Digikey; ComponentLink5Description: https://datasheet.ciiva.com/683/1040310811-sd-683580.pdf?src-supplier=Digikey; ComponentLink6URL: https://datasheet.ciiva.com/683/1040310811-sd-683581.pdf?src-supplier=Digikey; ComponentLink6Description: https://datasheet.ciiva.com/683/1040310811-sd-683581.pdf?src-supplier=Digikey; ComponentLink7URL: https://datasheet.ciiva.com/15174/getdatasheetpartid-716154-15174887.pdf?src-supplier=Verical; ComponentLink7Description: https://datasheet.ciiva.com/15174/getdatasheetpartid-716154-15174887.pdf?src-supplier=Verical; Supplier Part Number 1: WM6357TR-ND
R60-R65 R67 = RP73PF1E10KBTD: as R25-R30 on sheet 14_LCD_TS_CT; Part Number: RP73PF1E10KBTD; Value: 10 kOhms; ComponentLink1Description: Datasheet; ComponentLink1URL: https://www.te.com/commerce/DocumentDelivery/DDEController?Action=srchrtrv&DocNm=1773272&DocType=DS&DocLang=English; ComponentLink2Description: DigiKey Link; ComponentLink2URL: https://www.digikey.com/en/products/detail/te-connectivity-passive-product/RP73PF1E10KBTD/8260957; Composition: Thin Film; Device Package: 0402 (1005 Metric); Height - Seated (Max): 0.014" (0.35mm); LastUpdated: 2/9/2024 8:30:24 PM; Lifecycle Status: Active; Minimum Order: 1; Number of Terminations: 2; Operating Temperature: -55°C ~ 155°C; Package / Case: 0402 (1005 Metric); Packaging: TapeAndReel; PartId: 2434; Part Status: Active; Price: 0.08; Resistance: 10 kOhms; Series: RP73, Holsworthy; Size / Dimension: 0.039" L x 0.020" W (1.00mm x 0.50mm); Supplier 1: DigiKey; Supplier Part Number 1: A127415CT-ND; Supplier Device Package: 0402; Tolerance: ±0.1%
R66 = ERJ-U02D1001X: 0402 ANTI-SULFUR RES. , 0.5%, 1K; Manufacturer: Panasonic Electronic Components; Power (Watts): 0.1W, 1/10W; Temperature Coefficient: ±200ppm/°C; Part Number: ERJ-U02D1001X; Value: 1 kOhms; ComponentLink1Description: Datasheet; ComponentLink1URL: https://industrial.panasonic.com/cdbs/www-data/pdf/RDP0000/AOA0000C334.pdf; ComponentLink2Description: DigiKey Link; ComponentLink2URL: https://www.digikey.com/en/products/detail/panasonic-electronic-components/ERJ-U02D1001X/9365326; Composition: Thick Film; Device Package: 0402 (1005 Metric); Features: Anti-Sulfur, Automotive AEC-Q200; Height - Seated (Max): 0.016" (0.40mm); LastUpdated: 2/9/2024 8:28:26 PM; Lifecycle Status: Active; Minimum Order: 1; Number of Terminations: 2; Operating Temperature: -55°C ~ 155°C; Package / Case: 0402 (1005 Metric); Packaging: TapeAndReel; PartId: 81776; Price: 0.01; Ratings: AEC-Q200; Resistance: 1 kOhms; Series: ERJ-U02; Size / Dimension: 0.039" L x 0.020" W (1.00mm x 0.50mm); Supplier 1: DigiKey; Supplier Part Number 1: 10-ERJ-U02D1001XCT-ND; Supplier Device Package: 0402; Tolerance: ±0.5%

## Sheet 18_GPS_Interface.SchDoc: =TitleParameter
size A3; Address: Crete IL; Organization: ASISGUARD; Address1: Kemalpasa, Kemalpasa Cd. No:290 D:292H, 35060 Bornova/Izmir/Turkey; Revision: R1M1
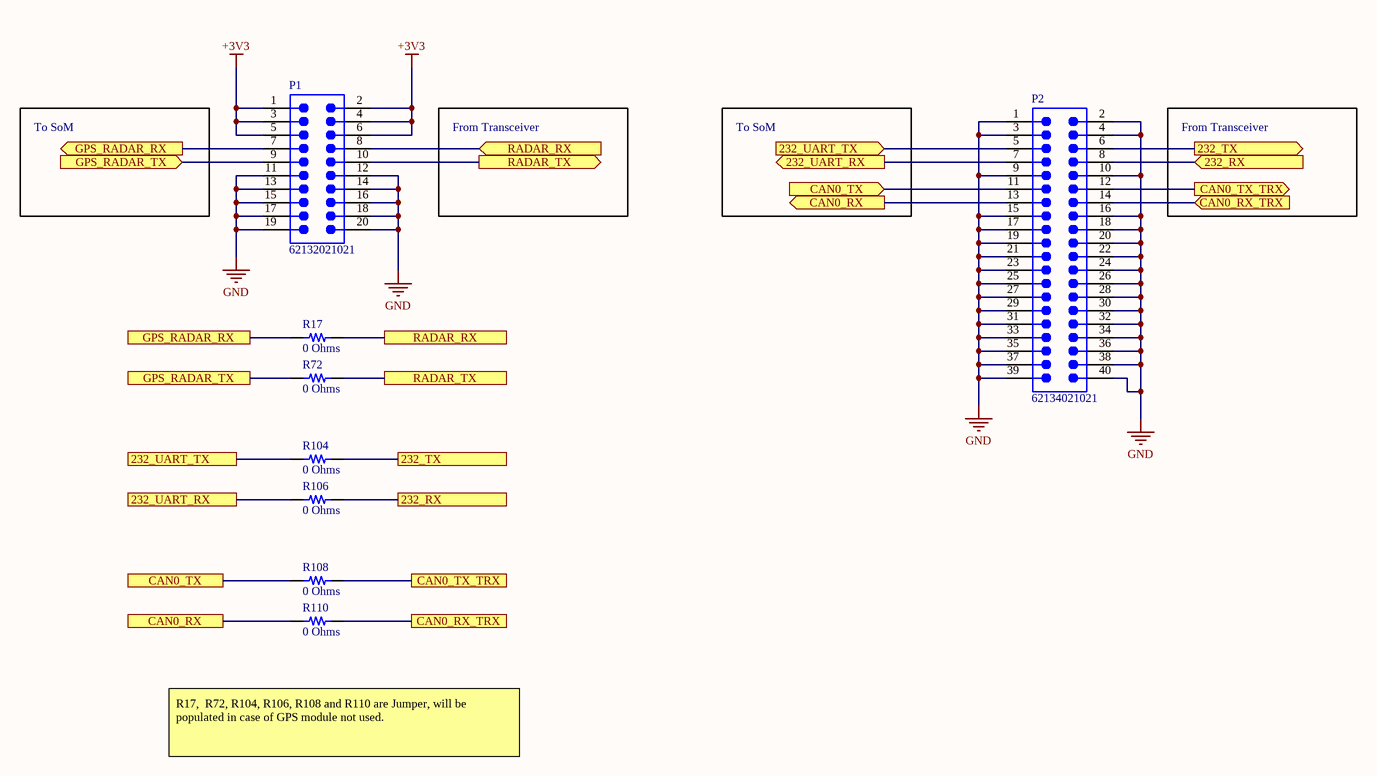
[diagram p17: 18_GPS_Interface.SchDoc]

### Parts
P1  62132021021  [62132021021]
P2  62134021021  [62134021021]
R17  0 Ohms  [RES0402(1005)]
R72  0 Ohms  [RES0402]
R104  0 Ohms  [RES0402(1005)]
R106  0 Ohms  [RES0402]
R108  0 Ohms  [RES0402(1005)]
R110  0 Ohms  [RES0402]

### Ports
232_RX, 232_RX (in), 232_TX, 232_TX (out), 232_UART_RX, 232_UART_RX (out), 232_UART_TX, 232_UART_TX (in), CAN0_RX, CAN0_RX (out), CAN0_RX_TRX, CAN0_RX_TRX (in), CAN0_TX, CAN0_TX (in), CAN0_TX_TRX, CAN0_TX_TRX (out), GPS_RADAR_RX, GPS_RADAR_RX (out), GPS_RADAR_TX, GPS_RADAR_TX (in), RADAR_RX, RADAR_RX (in), RADAR_TX, RADAR_TX (out)

### Nets
+3V3: P1.1 P1.2 P1.3 P1.4 P1.5 P1.6
GND: P1.11 P1.12 P1.13 P1.14 P1.15 P1.16 P1.17 P1.18 P1.19 P1.20 P2.1 P2.2 P2.3 P2.4 P2.9 P2.10 P2.15 P2.16 P2.17 P2.18 P2.19 P2.20 P2.21 P2.22 P2.23 P2.24 P2.25 P2.26 P2.27 P2.28 P2.29 P2.30 P2.31 P2.32 P2.33 P2.34 P2.35 P2.36 P2.37 P2.38 P2.39 P2.40
232_UART_RX: P2.8 R106.1 ; port 232_RX
232_UART_TX: P2.6 R104.1 ; port 232_TX
CAN0_RX: P2.14 R110.1 ; port CAN0_RX_TRX
CAN0_TX: P2.12 R108.1 ; port CAN0_TX_TRX
RADAR_RX: P1.8 R17.1 ; port RADAR_RX
RADAR_TX: P1.10 R72.1 ; port RADAR_TX
NetP1_7: P1.7 R17.2 ; port GPS_RADAR_RX
NetP1_9: P1.9 R72.2 ; port GPS_RADAR_TX
NetP2_5: P2.5 R104.2 ; port 232_UART_TX
NetP2_7: P2.7 R106.2 ; port 232_UART_RX
NetP2_11: P2.11 R108.2 ; port CAN0_TX
NetP2_13: P2.13 R110.2 ; port CAN0_RX

### Notes on the sheet
- To SoM
- From Transceiver
- R17,  R72, R104, R106, R108 and R110 are Jumper, will be populated in case of GPS module not used.
- Proje/Project:
- Sayfa Adı/Document Name:
- Çizilme Tarihi/Drawing Date
- Umit KAYACIK
- Tasarlayan/Designed By
- Sayfa/Sheet:
- Revision:
- of
- Son Güncelleme/Last Edit Date
- Kontrol eden/Checked By
- Onaylayan/Approved By
- Boyut/Size:
- Varyant/Variant:
- Dil/Language:
- A3
- ENG

### Library data of the parts
P1 = CMP-03913-122473367-2: 62132021021 Conn, Header, 20Pos, 2Row, 1.27Mm Rohs Compliant: Yes; NexarPartId: 122473367
P2 = CMP-03913-122473373-2: 62134021021 Conn, Header, 40Pos, 2Row, 1.27Mm Rohs Compliant: Yes; NexarPartId: 122473373
R17 R72 R104 R106 R108 R110 = HCJ0402ZT0R00: as R128 on sheet 14_LCD_TS_CT; Part Number: HCJ0402ZT0R00; Value: 0 Ohms; ComponentLink1Description: Datasheet; ComponentLink1URL: https://www.seielect.com/catalog/sei-hcj.pdf; ComponentLink2Description: DigiKey Link; ComponentLink2URL: https://www.digikey.com/en/products/detail/stackpole-electronics-inc/HCJ0402ZT0R00/4357659; Composition: Metal Foil; Device Package: 0402 (1005 Metric); Features: Automotive AEC-Q200; Height - Seated (Max): 0.018" (0.45mm); LastUpdated: 2/9/2024 8:29:49 PM; Lifecycle Status: Active; Minimum Order: 1; Number of Terminations: 2; Operating Temperature: -55°C ~ 155°C; Package / Case: 0402 (1005 Metric); Packaging: TapeAndReel; PartId: 12327; Part Status: Active; Price: 0.07; Ratings: AEC-Q200; Resistance: 0 Ohms; Series: HCJ; Size / Dimension: 0.039" L x 0.020" W (1.00mm x 0.50mm); Supplier 1: DigiKey; Supplier Part Number 1: HCJ0402ZT0R00CT-ND; Supplier Device Package: 0402; Tolerance: Jumper

## Nets that join several sheets
+3V3: 03_POWER_PROTECTION_MONITORING (5 pins), 04_VOLTAGE_CONVERTER (7 pins), 06_BUTTONS (17 pins), 07_GSM_EM05 (R75.2), 08_RADAR_INTERFACE (C31.2 U2.1), 09_RS-232_EXT (FB6.2), 12_PERIPHERALS (5 pins), 14_LCD_TS_CT (16 pins), 15_CAN_BUS (FB3.1 TP18.1), 16_DEBUG (R38.2), 18_GPS_Interface (6 pins)
+5V0: 04_VOLTAGE_CONVERTER (9 pins), 10_USB_HOST (5 pins), 11_MYIR (C52.2 C53.2 C54.2 R68.2)
+12V: 03_POWER_PROTECTION_MONITORING (5 pins), 04_VOLTAGE_CONVERTER (6 pins), 05_CONNECTORS (J7.3 J10.1 J11.3), 13_LED_BACKLIGHT (C41.1 L3.1 R42.2 TP21.1)
CHS_GND: 03_POWER_PROTECTION_MONITORING (C2.2 C3.2 C9.1 C10.1), 07_GSM_EM05 (C74.1 R83.1), 12_PERIPHERALS (5 pins)
GND: 03_POWER_PROTECTION_MONITORING (6 pins), 04_VOLTAGE_CONVERTER (30 pins), 05_CONNECTORS (13 pins), 06_BUTTONS (8 pins), 07_GSM_EM05 (45 pins), 08_RADAR_INTERFACE (C31.1 D4.3 D5.3 U2.4), 09_RS-232_EXT (6 pins), 10_USB_HOST (7 pins), 11_MYIR (38 pins), 12_PERIPHERALS (13 pins), 13_LED_BACKLIGHT (13 pins), 14_LCD_TS_CT (18 pins), 15_CAN_BUS (6 pins), 16_DEBUG (D14.1 D15.1), 17_SD_CARD (15 pins), 18_GPS_Interface (42 pins)
GND_IN: 03_POWER_PROTECTION_MONITORING (5 pins), 05_CONNECTORS (J6.4 J6.5 J6.6)
SOM_3V3OUT: 11_MYIR (C58.2 C59.2 U8.63), 12_PERIPHERALS (R95.2 R97.2), 17_SD_CARD (C50.2 C51.2 FB4.1)
VCC_GSM: 04_VOLTAGE_CONVERTER (6 pins), 07_GSM_EM05 (22 pins)
VCC_USB_HOST: 05_CONNECTORS (J9.1), 10_USB_HOST (5 pins)
VIN: 03_POWER_PROTECTION_MONITORING (6 pins), 05_CONNECTORS (J6.1 J6.2 J6.3)
4G_RST: 07_GSM_EM05 (R76.1), 11_MYIR (U8.108)
4G_USB_N: 07_GSM_EM05 (D27.2 R81.1), 11_MYIR (U8.114)
4G_USB_P: 07_GSM_EM05 (D28.2 R80.1), 11_MYIR (U8.113)
232_UART_RX: 09_RS-232_EXT (R70.2), 18_GPS_Interface (P2.8 R106.1)
232_UART_TX: 09_RS-232_EXT (R69.2), 18_GPS_Interface (P2.6 R104.1)
CAN0_N: 05_CONNECTORS (J7.2), 15_CAN_BUS (C36.2 D11.1 R32.2 T1.4)
CAN0_P: 05_CONNECTORS (J7.1), 15_CAN_BUS (C37.2 D11.2 R32.1 T1.3)
CAN0_RX: 15_CAN_BUS (R33.2), 18_GPS_Interface (P2.14 R110.1)
CAN0_TX: 15_CAN_BUS (R31.2), 18_GPS_Interface (P2.12 R108.1)
CTP_#INT: 11_MYIR (U8.98), 14_LCD_TS_CT (J2.5 R30.1)
CTP_#RESET: 11_MYIR (U8.99), 14_LCD_TS_CT (J2.6 R27.1)
CTP_SCL: 11_MYIR (U8.78), 14_LCD_TS_CT (J2.3 R29.1)
CTP_SDA: 11_MYIR (U8.79), 14_LCD_TS_CT (J2.4 R28.1)
DBG_UART_RX: 11_MYIR (U8.106), 16_DEBUG (D13.2 R38.1)
DBG_UART_TX: 11_MYIR (U8.105), 16_DEBUG (R39.2)
DEBUG_RX: 05_CONNECTORS (J8.2), 16_DEBUG (R41.1)
DEBUG_TX: 05_CONNECTORS (J8.1), 16_DEBUG (R40.1)
H_USBA_HOST_D_N: 05_CONNECTORS (J9.2), 10_USB_HOST (L2.3)
H_USBA_HOST_D_P: 05_CONNECTORS (J9.3), 10_USB_HOST (L2.4)
I2C2_SCL: 03_POWER_PROTECTION_MONITORING (IC1.5 R5.1), 11_MYIR (U8.84)
I2C2_SDA: 03_POWER_PROTECTION_MONITORING (IC1.6 R8.1), 11_MYIR (U8.83)
INT#/SQW: 11_MYIR (U8.95), 12_PERIPHERALS (R58.1 U7.3)
LCD_BL_EN: 11_MYIR (U8.101), 13_LED_BACKLIGHT (D17.1)
LCD_BL_PWM: 11_MYIR (U8.96), 13_LED_BACKLIGHT (R51.1)
LCD_LED_ANODE: 13_LED_BACKLIGHT (C42.1 D16.1 R47.2), 14_LCD_TS_CT (J1.39 J1.40 TP14.1)
LCD_LED_CATHODE: 13_LED_BACKLIGHT (R53.2 R54.2 R55.2), 14_LCD_TS_CT (J1.36 J1.37 TP13.1)
LVDS0_CLK_N: 11_MYIR (U8.129), 14_LCD_TS_CT (D10.1 D10.6 J1.17)
LVDS0_CLK_P: 11_MYIR (U8.130), 14_LCD_TS_CT (D10.3 D10.4 J1.18)
LVDS0_D0_N: 11_MYIR (U8.120), 14_LCD_TS_CT (D6.1 D6.6 J1.8)
LVDS0_D0_P: 11_MYIR (U8.121), 14_LCD_TS_CT (D6.3 D6.4 J1.9)
LVDS0_D1_N: 11_MYIR (U8.123), 14_LCD_TS_CT (D7.1 D7.6 J1.11)
LVDS0_D1_P: 11_MYIR (U8.124), 14_LCD_TS_CT (D7.3 D7.4 J1.12)
LVDS0_D2_N: 11_MYIR (U8.126), 14_LCD_TS_CT (D8.1 D8.6 J1.14)
LVDS0_D2_P: 11_MYIR (U8.127), 14_LCD_TS_CT (D8.3 D8.4 J1.15)
LVDS0_D3_N: 11_MYIR (U8.132), 14_LCD_TS_CT (D9.1 D9.6 J1.20)
LVDS0_D3_P: 11_MYIR (U8.133), 14_LCD_TS_CT (D9.3 D9.4 J1.21)
NetC49_2: 11_MYIR (U8.73), 12_PERIPHERALS (C49.2 D18.2 S1.1 S1.2)
NetIC4_12: 06_BUTTONS (IC4.12 R84.1), 11_MYIR (U8.11)
NetIC4_13: 06_BUTTONS (IC4.13 R89.1), 11_MYIR (U8.12)
NetIC4_19: 06_BUTTONS (IC4.19), 11_MYIR (U8.53)
NetIC4_20: 06_BUTTONS (IC4.20), 11_MYIR (U8.52)
NetJ12_1: 05_CONNECTORS (J12.1), 06_BUTTONS (R98.1)
NetJ12_2: 05_CONNECTORS (J12.2), 06_BUTTONS (R94.1)
NetJ12_3: 05_CONNECTORS (J12.3), 06_BUTTONS (R92.1)
NetJ12_4: 05_CONNECTORS (J12.4), 06_BUTTONS (R90.1)
NetJ12_5: 05_CONNECTORS (J12.5), 06_BUTTONS (R87.1)
NetJ12_6: 05_CONNECTORS (J12.6), 06_BUTTONS (R85.1)
NetP1_7: 11_MYIR (U8.109), 18_GPS_Interface (P1.7 R17.2)
NetP1_9: 11_MYIR (U8.107), 18_GPS_Interface (P1.9 R72.2)
NetP2_5: 11_MYIR (U8.47), 18_GPS_Interface (P2.5 R104.2)
NetP2_7: 11_MYIR (U8.48), 18_GPS_Interface (P2.7 R106.2)
NetP2_11: 11_MYIR (U8.15), 18_GPS_Interface (P2.11 R108.2)
NetP2_13: 11_MYIR (U8.16), 18_GPS_Interface (P2.13 R110.2)
NetR13_1: 04_VOLTAGE_CONVERTER (R13.1), 11_MYIR (U8.46)
NetR15_1: 04_VOLTAGE_CONVERTER (R15.1), 11_MYIR (U8.45)
NetR16_1: 07_GSM_EM05 (R16.1 R75.1), 11_MYIR (U8.111)
NetR56_1: 11_MYIR (U8.13), 12_PERIPHERALS (R56.1 U7.7)
NetR57_1: 11_MYIR (U8.17), 12_PERIPHERALS (R57.1 U7.8)
NetR95_1: 11_MYIR (U8.50), 12_PERIPHERALS (R95.1 R99.1)
NetR97_1: 11_MYIR (U8.49), 12_PERIPHERALS (R97.1 R105.1)
RADAR_RX: 08_RADAR_INTERFACE (R21.2), 18_GPS_Interface (P1.8 R17.1)
RADAR_TX: 08_RADAR_INTERFACE (R22.2), 18_GPS_Interface (P1.10 R72.1)
RS232_RX: 05_CONNECTORS (J11.2), 09_RS-232_EXT (D26.1 IC3.13)
RS232_TX: 05_CONNECTORS (J11.1), 09_RS-232_EXT (D26.2 IC3.14)
RS422_RX_N: 05_CONNECTORS (J10.6), 08_RADAR_INTERFACE (D4.2 R19.1 R20.2)
RS422_RX_P: 05_CONNECTORS (J10.3), 08_RADAR_INTERFACE (D4.1 R18.2 R19.2)
RS422_TX_N: 05_CONNECTORS (J10.2), 08_RADAR_INTERFACE (D5.1 R23.2)
RS422_TX_P: 05_CONNECTORS (J10.5), 08_RADAR_INTERFACE (D5.2 R24.2)
RST_BTN: 06_BUTTONS (C82.2 IC4.18 R100.1), 11_MYIR (U8.102)
RTC_RES: 11_MYIR (U8.94), 12_PERIPHERALS (R59.1 U7.4)
SDC0-CLK: 11_MYIR (U8.61), 17_SD_CARD (D20.2 J3.5 R60.1)
SDC0-CMD: 11_MYIR (U8.56), 17_SD_CARD (D21.2 J3.3 R61.1)
SDC0-D0: 11_MYIR (U8.54), 17_SD_CARD (D22.2 J3.7 R62.1)
SDC0-D1: 11_MYIR (U8.55), 17_SD_CARD (D23.2 J3.8 R63.1)
SDC0-D2: 11_MYIR (U8.58), 17_SD_CARD (D24.2 J3.1 R64.1)
SDC0-D3: 11_MYIR (U8.57), 17_SD_CARD (D25.2 J3.2 R65.1)
SDC0-DET: 11_MYIR (U8.59), 17_SD_CARD (R66.1)
TFT_#RES: 11_MYIR (U8.6), 14_LCD_TS_CT (J1.5 R25.1)
TFT_#STBYB: 11_MYIR (U8.3), 14_LCD_TS_CT (J1.6 R26.1)
TFT_SHLR: 11_MYIR (U8.5), 14_LCD_TS_CT (J1.33)
TFT_UPDN: 11_MYIR (U8.2), 14_LCD_TS_CT (J1.34)
USBA_HOST_D_N: 10_USB_HOST (L2.2 U5.4), 11_MYIR (U8.117)
USBA_HOST_D_P: 10_USB_HOST (L2.1 U5.3), 11_MYIR (U8.116)

## Assembly variants
Variant of HW_RV_TOUCH_R1M1: not fitted C44 C45 C47 R1 R2 R16 R50 R55 R60 R61 R62 R63 R64 R65 R95 R97 R99 R105 R137